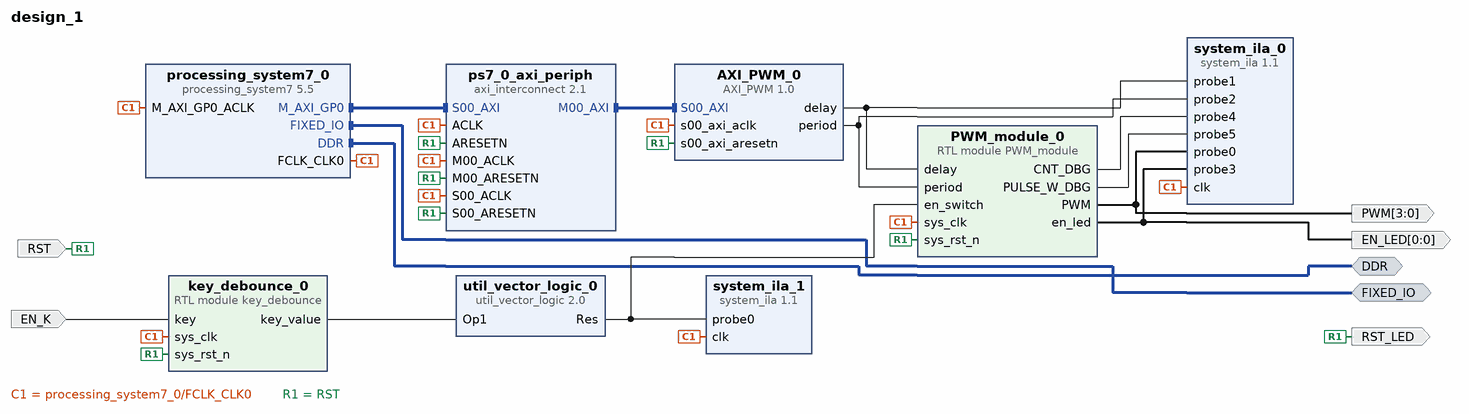
[diagram p0: block diagram of the top level]
# Vivado block design design_1, xc7z020clg400-2, Vivado 2018.3
create_bd_design design_1

create_bd_intf_port -mode Master -vlnv xilinx.com:interface:ddrx_rtl:1.0 DDR
create_bd_intf_port -mode Master -vlnv xilinx.com:display_processing_system7:fixedio_rtl:1.0 FIXED_IO
create_bd_port -dir I EN_K
create_bd_port -dir O -from 3 -to 0 PWM
create_bd_port -dir I RST
create_bd_port -dir O RST_LED
create_bd_port -dir O -from 0 -to 0 EN_LED

create_bd_cell -type ip -vlnv xilinx.com:ip:processing_system7:5.5 processing_system7_0
set_property -dict [list \
  CONFIG.PCW_EN_RST0_PORT 0 \
  CONFIG.PCW_FPGA0_PERIPHERAL_FREQMHZ 200 \
  CONFIG.PCW_GPIO_MIO_GPIO_ENABLE 1 \
  CONFIG.PCW_GPIO_MIO_GPIO_IO MIO \
  CONFIG.PCW_I2C_RESET_ENABLE 1 \
  CONFIG.PCW_PRESET_BANK1_VOLTAGE {LVCMOS 1.8V} \
  CONFIG.PCW_QSPI_GRP_SINGLE_SS_ENABLE 1 \
  CONFIG.PCW_QSPI_GRP_SINGLE_SS_IO {MIO 1 .. 6} \
  CONFIG.PCW_QSPI_PERIPHERAL_ENABLE 1 \
  CONFIG.PCW_QSPI_QSPI_IO {MIO 1 .. 6} \
  CONFIG.PCW_SD0_GRP_CD_ENABLE 0 \
  CONFIG.PCW_SD0_GRP_WP_ENABLE 0 \
  CONFIG.PCW_SD0_PERIPHERAL_ENABLE 1 \
  CONFIG.PCW_SD0_SD0_IO {MIO 16 .. 21} \
  CONFIG.PCW_SDIO_PERIPHERAL_FREQMHZ 100 \
  CONFIG.PCW_SINGLE_QSPI_DATA_MODE x4 \
  CONFIG.PCW_UART0_PERIPHERAL_ENABLE 1 \
  CONFIG.PCW_UART0_UART0_IO {MIO 14 .. 15} \
  CONFIG.PCW_UART_PERIPHERAL_FREQMHZ 100 \
  CONFIG.PCW_UIPARAM_DDR_PARTNO {MT41J256M16 RE-125} \
  CONFIG.PCW_USB_RESET_ENABLE 1 \
] [get_bd_cells processing_system7_0]
# 200 more settings of processing_system7_0 are not shown: defaults, MIO pin electricals, DDR timing, and values the tool derives
create_bd_cell -type module -reference key_debounce key_debounce_0
create_bd_cell -type ip -vlnv xilinx.com:ip:axi_interconnect:2.1 ps7_0_axi_periph
set_property -dict {CONFIG.NUM_MI 1} [get_bd_cells ps7_0_axi_periph]
create_bd_cell -type ip -vlnv xilinx.com:ip:util_vector_logic:2.0 util_vector_logic_0
set_property -dict {CONFIG.C_OPERATION not CONFIG.C_SIZE 1} [get_bd_cells util_vector_logic_0]
create_bd_cell -type ip -vlnv xilinx.com:ip:system_ila:1.1 system_ila_0
set_property -dict [list \
  CONFIG.C_MON_TYPE NATIVE \
  CONFIG.C_NUM_OF_PROBES 6 \
  CONFIG.C_PROBE0_TYPE 0 \
  CONFIG.C_PROBE1_TYPE 0 \
  CONFIG.C_PROBE2_TYPE 0 \
] [get_bd_cells system_ila_0]
create_bd_cell -type ip -vlnv xilinx.com:ip:system_ila:1.1 system_ila_1
set_property -dict {CONFIG.C_MON_TYPE NATIVE CONFIG.C_NUM_OF_PROBES 1 CONFIG.C_PROBE0_TYPE 0} [get_bd_cells system_ila_1]
create_bd_cell -type ip -vlnv xilinx.com:user:AXI_PWM:1.0 AXI_PWM_0
create_bd_cell -type module -reference PWM_module PWM_module_0

# ---- connections ----

connect_bd_intf_net [get_bd_intf_ports FIXED_IO] [get_bd_intf_pins processing_system7_0/FIXED_IO]
connect_bd_intf_net [get_bd_intf_ports DDR] [get_bd_intf_pins processing_system7_0/DDR]
connect_bd_intf_net [get_bd_intf_pins processing_system7_0/M_AXI_GP0] [get_bd_intf_pins ps7_0_axi_periph/S00_AXI]
connect_bd_intf_net [get_bd_intf_pins ps7_0_axi_periph/M00_AXI] [get_bd_intf_pins AXI_PWM_0/S00_AXI]
connect_bd_net [get_bd_pins processing_system7_0/FCLK_CLK0] \
  [get_bd_pins key_debounce_0/sys_clk] [get_bd_pins processing_system7_0/M_AXI_GP0_ACLK] \
  [get_bd_pins ps7_0_axi_periph/S00_ACLK] [get_bd_pins ps7_0_axi_periph/M00_ACLK] [get_bd_pins ps7_0_axi_periph/ACLK] \
  [get_bd_pins system_ila_0/clk] [get_bd_pins system_ila_1/clk] [get_bd_pins AXI_PWM_0/s00_axi_aclk] \
  [get_bd_pins PWM_module_0/sys_clk]
connect_bd_net -net AXI_PWM_0_delay [get_bd_pins AXI_PWM_0/delay] [get_bd_pins system_ila_0/probe1] [get_bd_pins PWM_module_0/delay]
connect_bd_net -net AXI_PWM_0_period [get_bd_pins AXI_PWM_0/period] [get_bd_pins system_ila_0/probe2] [get_bd_pins PWM_module_0/period]
connect_bd_net -net PWM_module_0_PWM [get_bd_pins PWM_module_0/PWM] [get_bd_ports PWM] [get_bd_pins system_ila_0/probe0]
connect_bd_net [get_bd_pins key_debounce_0/key_value] [get_bd_pins util_vector_logic_0/Op1]
connect_bd_net [get_bd_ports RST] \
  [get_bd_pins ps7_0_axi_periph/ARESETN] [get_bd_pins ps7_0_axi_periph/S00_ARESETN] \
  [get_bd_pins ps7_0_axi_periph/M00_ARESETN] [get_bd_pins key_debounce_0/sys_rst_n] [get_bd_ports RST_LED] \
  [get_bd_pins AXI_PWM_0/s00_axi_aresetn] [get_bd_pins PWM_module_0/sys_rst_n]
connect_bd_net [get_bd_ports EN_K] [get_bd_pins key_debounce_0/key]
connect_bd_net -net util_vector_logic_0_Res [get_bd_pins util_vector_logic_0/Res] \
  [get_bd_pins system_ila_1/probe0] [get_bd_pins PWM_module_0/en_switch]
connect_bd_net [get_bd_pins PWM_module_0/en_led] [get_bd_ports EN_LED] [get_bd_pins system_ila_0/probe3]
connect_bd_net [get_bd_pins PWM_module_0/CNT_DBG] [get_bd_pins system_ila_0/probe4]
connect_bd_net [get_bd_pins PWM_module_0/PULSE_W_DBG] [get_bd_pins system_ila_0/probe5]
set_property HDL_ATTRIBUTE.DEBUG true [get_bd_nets AXI_PWM_0_delay]
set_property HDL_ATTRIBUTE.MARK_DEBUG true [get_bd_nets AXI_PWM_0_delay]
set_property HDL_ATTRIBUTE.DEBUG true [get_bd_nets AXI_PWM_0_period]
set_property HDL_ATTRIBUTE.MARK_DEBUG true [get_bd_nets AXI_PWM_0_period]
set_property HDL_ATTRIBUTE.DEBUG true [get_bd_nets PWM_module_0_PWM]
set_property HDL_ATTRIBUTE.MARK_DEBUG true [get_bd_nets PWM_module_0_PWM]
set_property HDL_ATTRIBUTE.DEBUG true [get_bd_nets util_vector_logic_0_Res]
set_property HDL_ATTRIBUTE.MARK_DEBUG true [get_bd_nets util_vector_logic_0_Res]

# ---- address map ----
assign_bd_address -offset 0x43C00000 -range 64K -target_address_space [get_bd_addr_spaces processing_system7_0/Data] [get_bd_addr_segs AXI_PWM_0/S00_AXI/S00_AXI_reg]

validate_bd_design
save_bd_design
